# Altium schematic sheet COMMS.schdoc
size 365 x 287 mm
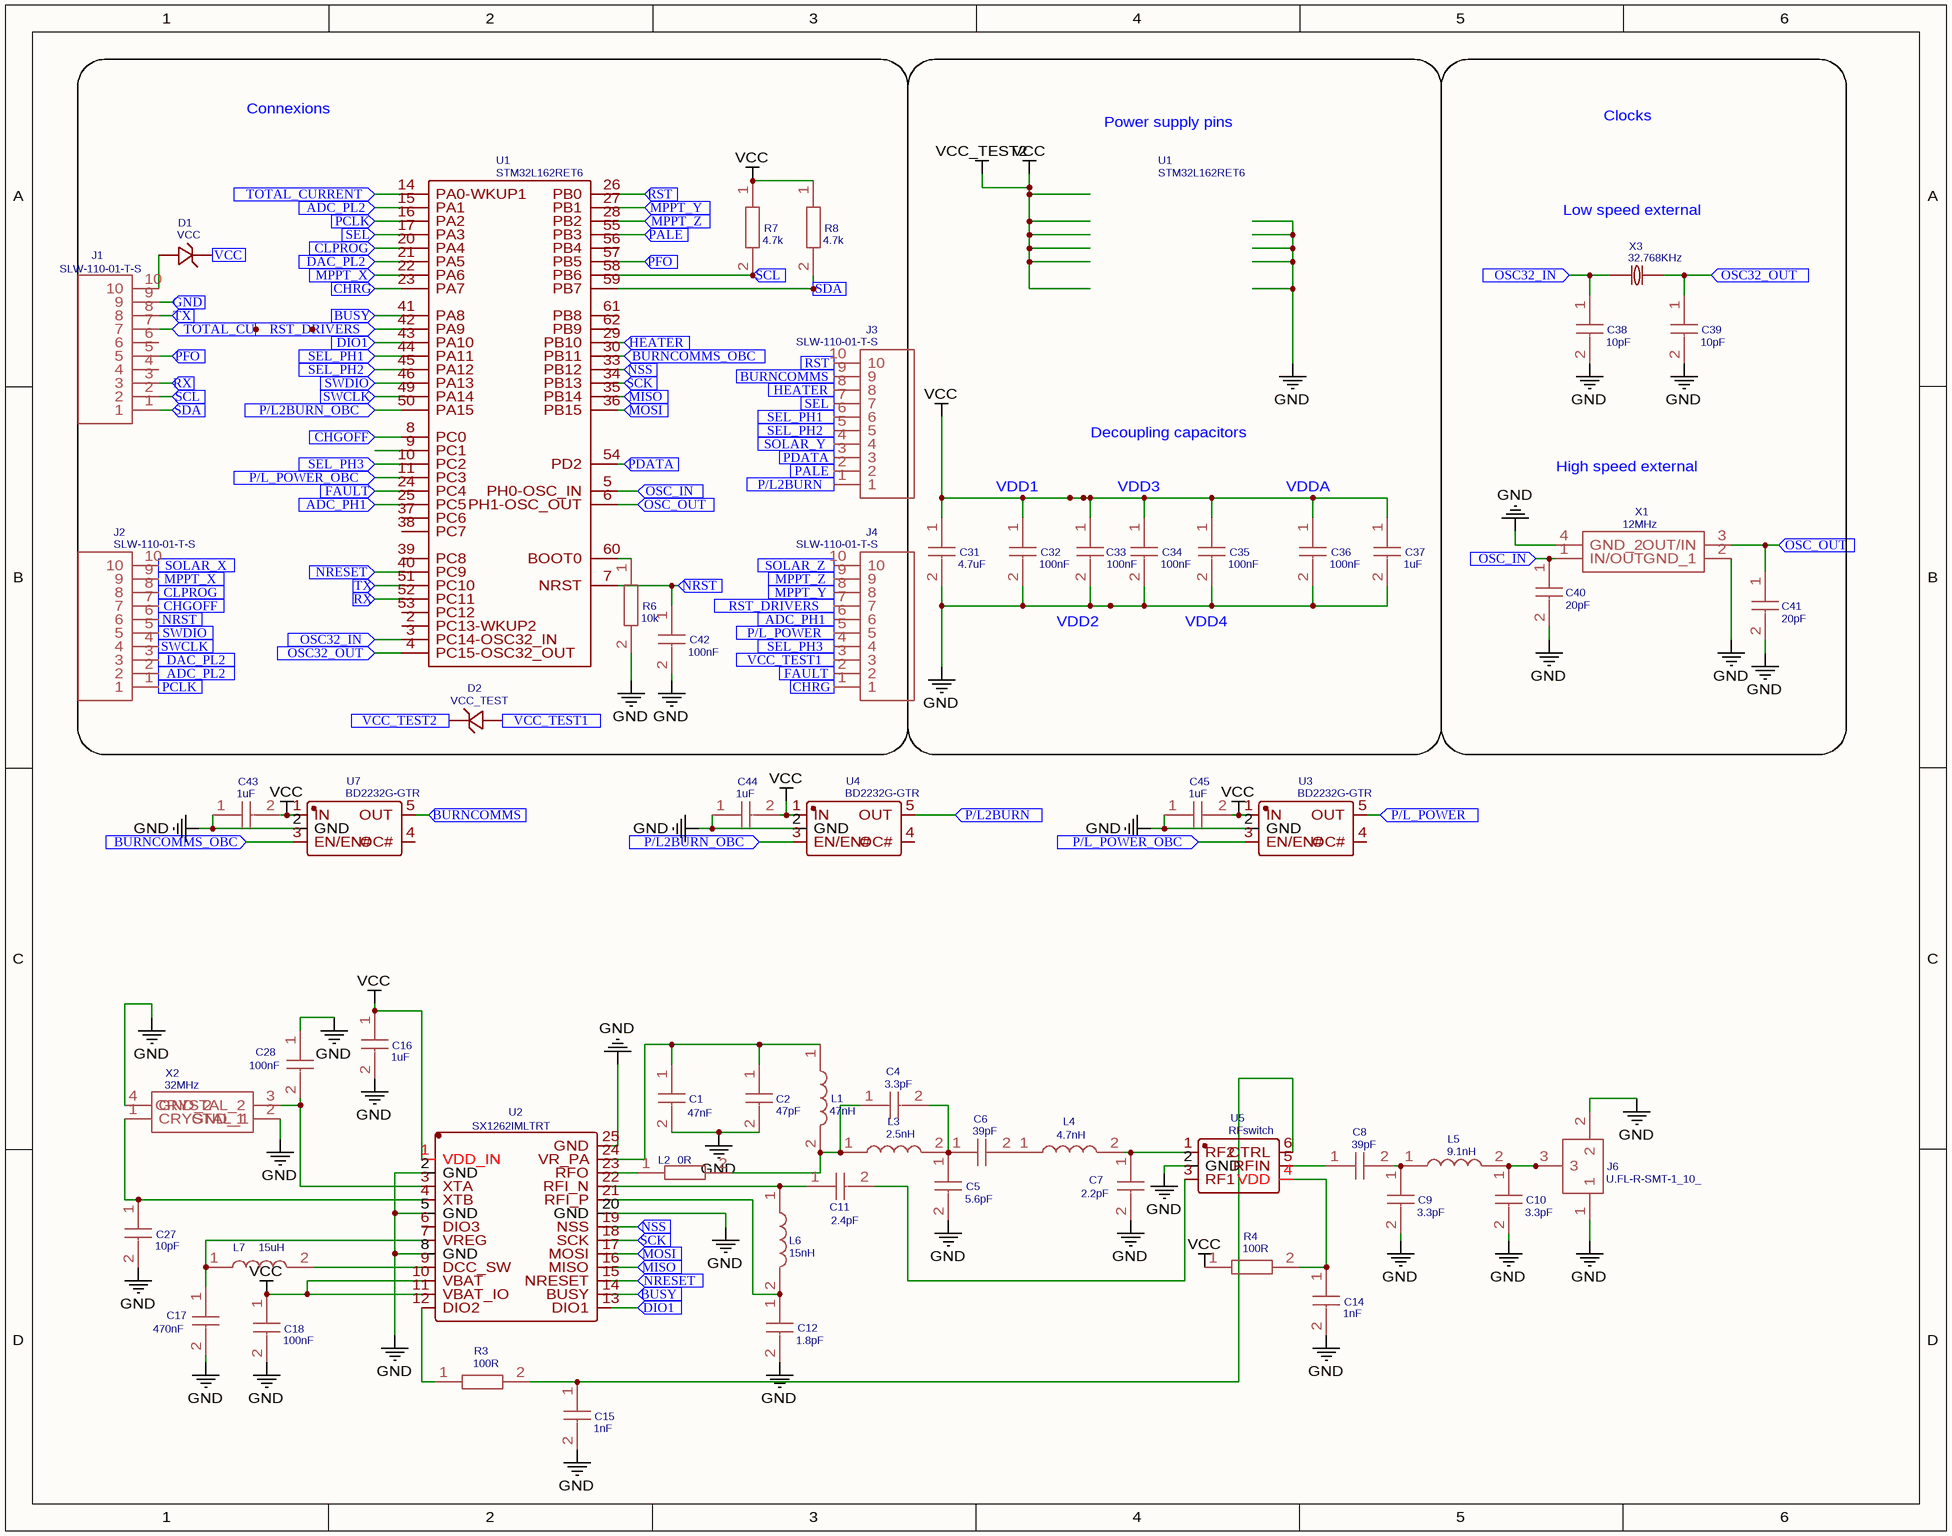
[diagram p0: COMMS.schdoc]

## Parts
(Parts that share a designator on the sheet are numbered #1, #2 ... from top to bottom, then left to right.)
C1  47nF  [CAPC1005X55N]
C2  47pF  [CAPC1005X55N]
C4  3.3pF  [CAPC1005X55N]
C5  5.6pF  [CAPC1005X55N]
C6  39pF  [CAPC1005X55N]
C7  2.2pF  [CAPC1005X55N]
C8  39pF  [CAPC1005X55N]
C9  3.3pF  [CAPC1005X55N]
C10  3.3pF  [CAPC1005X55N]
C11  2.4pF  [CAPC1005X55N]
C12  1.8pF  [CAPC1005X55N]
C14  1nF  [CAPC1608X90N]
C15  1nF  [CAPC1608X90N]
C16  1uF  [CAPC1608X90N]
C17  470nF  [CAPC1608X90N]
C18  100nF  [CAPC1608X90N]
C27  10pF  [CAPC1608X90N]
C28  100nF  [CAPC1608X90N]
C31  4.7uF  [CAPC1608X90N]
C32  100nF  [CAPC1608X90N]
C33  100nF  [CAPC1608X90N]
C34  100nF  [CAPC1608X90N]
C35  100nF  [CAPC1608X90N]
C36  100nF  [CAPC1608X90N]
C37  1uF  [CAPC1608X90N]
C38  10pF  [CAPC1608X80N]
C39  10pF  [CAPC1608X80N]
C40  20pF  [CAPC1608X90N]
C41  20pF  [CAPC1608X90N]
C42  100nF  [CAPC1608X90N]
C43  1uF  [CAPC1608X90N]
C44  1uF  [CAPC1608X90N]
C45  1uF  [CAPC1608X90N]
D1  VCC  [SOD-128_L3.7-W2.5-LS4.7-FD]
D2  VCC_TEST  [SOD-128_L3.7-W2.5-LS4.7-FD]
J1  SLW-110-01-T-S  [SLW-110-01-X-S]
J2  SLW-110-01-T-S  [SLW-110-01-X-S]
J3  SLW-110-01-T-S  [SLW-110-01-X-S]
J4  SLW-110-01-T-S  [SLW-110-01-X-S]
J6  U.FL-R-SMT-1_10_  [U.FL-R-SMT-1(10)]
L1  47nH  [LQW15CNR20J00B]
L2  0R  [RESC1005X35N]
L3  2.5nH  [LQW15CNR20J00B]
L4  4.7nH  [LQW15CNR20J00B]
L5  9.1nH  [LQW15CNR20J00B]
L6  15nH  [LQW15CNR20J00B]
L7  15uH  [INDC2012X145N]
R3  100R  [RESC1608X55N]
R4  100R  [RESC1608X55N]
R6  10k  [RESC1608X55N]
R7  4.7k  [RESC1608X55N]
R8  4.7k  [RESC1608X55N]
U1#1  STM32L162RET6  [STM-LQFP64]
U1#2  STM32L162RET6  [STM-LQFP64]
U2  SX1262IMLTRT  [QFN-24_L4.0-W4.0-P0.50-BL-EP2.6]
U3  BD2232G-GTR  [SSOP-5_L3.0-W1.6-P0.95-LS2.8-TL]
U4  BD2232G-GTR  [SSOP-5_L3.0-W1.6-P0.95-LS2.8-TL]
U5  RFswitch  [TSNP-6_L1.1-W0.7-P0.40-BR]
U7  BD2232G-GTR  [SSOP-5_L3.0-W1.6-P0.95-LS2.8-TL]
X1  12MHz  [ECS1201833JEMTR3]
X2  32MHz  [FA128320000MF20XK5]
X3  32.768KHz  [CRYSTAL-SMD_L4.1-W1.5]

## Blocks framed on the sheet
Connexions: C42 D1 D2 J1-J4 R6-R8 U1#2

## Ports
ADC_PH1 (in), ADC_PL2 (in), BURNCOMMS (in), BURNCOMMS_OBC (in), BUSY (in), CHGOFF (in), CHRG (in), CLPROG (in), DAC_PL2 (in), DIO1 (in), FAULT (in), GND (in), HEATER (in), MISO (in), MOSI (in), MPPT_X (in), MPPT_Y (in), MPPT_Z (in), NRESET (in), NRST (in), NSS (in), OSC32_IN (in), OSC32_OUT (in), OSC_IN (in), OSC_OUT (in), P/L2BURN (in), P/L2BURN_OBC (in), P/L_POWER (in), P/L_POWER_OBC (in), PALE (in), PCLK (in), PDATA (in), PFO (in), RST (in), RST_DRIVERS (in), RX (in), SCK (in), SCL (in), SDA (in), SEL (in), SEL_PH1 (in), SEL_PH2 (in), SEL_PH3 (in), SOLAR_X (in), SOLAR_Y (in), SOLAR_Z (in), SWCLK (in), SWDIO (in), TOTAL_CURRENT (in), TX (in), VCC (in), VCC_TEST1 (in), VCC_TEST2 (in)

## Nets
GND: C1.2 C2.2 C5.2 C7.2 C9.2 C10.2 C12.2 C14.2 C15.2 C16.2 C17.2 C18.2 C27.2 C28.1 C31.2 C32.2 C33.2 C34.2 C35.2 C36.2 C37.2 C38.2 C39.2 C40.2 C41.2 C42.2 C43.1 C44.1 C45.1 J6.1 J6.2 R6.2 U2.2(GND) U2.5(GND) U2.8(GND) U2.20(GND) U2.25(GND) U3.2(GND) U4.2(GND) U5.2(GND) U7.2(GND) X1.2(GND_1) X1.4(GND_2) X2.2(GND_1) X2.4(GND_2)
VCC: C16.1 C18.1 C31.1 C32.1 C33.1 C34.1 C35.1 C36.1 C37.1 C43.2 C44.2 C45.2 R4.1 R7.1 R8.1 U2.1(VDD_IN) U2.10(VBAT) U2.11(VBAT_IO) U3.1(IN) U4.1(IN) U7.1(IN)  [also labelled VCC_TEST2]
ADC_PH1: J4.6 U1#2.25(PC5) ; port ADC_PH1
ADC_PL2: J2.2 U1#2.15(PA1) ; port ADC_PL2
BURNCOMMS: J3.9 U7.5(OUT) ; port BURNCOMMS
BURNCOMMS_OBC: U1#2.30(PB11) U7.3(EN/EN#) ; port BURNCOMMS_OBC
BUSY: U1#2.41(PA8) U2.14(BUSY) ; port BUSY
CHGOFF: J2.7 U1#2.8(PC0) ; port CHGOFF
CHRG: J4.1 U1#2.23(PA7) ; port CHRG
CLPROG: J2.8 U1#2.20(PA4) ; port CLPROG
DAC_PL2: J2.3 U1#2.21(PA5) ; port DAC_PL2
DIO1: U1#2.43(PA10) U2.13(DIO1) ; port DIO1
FAULT: J4.2 U1#2.24(PC4) ; port FAULT
GND: J1.9 ; port GND  [a separate net that carries the same name]
HEATER: J3.8 U1#2.29(PB10) ; port HEATER
MISO: U1#2.35(PB14) U2.16(MISO) ; port MISO
MOSI: U1#2.36(PB15) U2.17(MOSI) ; port MOSI
MPPT_X: J2.9 U1#2.22(PA6) ; port MPPT_X
MPPT_Y: J4.8 U1#2.27(PB1) ; port MPPT_Y
MPPT_Z: J4.9 U1#2.28(PB2) ; port MPPT_Z
NRESET: U1#2.40(PC9) U2.15(NRESET) ; port NRESET
NRST: C42.1 J2.6 U1#2.7(NRST) ; port NRST
NSS: U1#2.33(PB12) U2.19(NSS) ; port NSS
OSC32_IN: C38.1 U1#2.3(PC14-OSC32_IN) X3.1 ; port OSC32_IN
OSC32_OUT: C39.1 U1#2.4(PC15-OSC32_OUT) X3.2 ; port OSC32_OUT
OSC_IN: C40.1 U1#2.5(PH0-OSC_IN) X1.1(IN/OUT) ; port OSC_IN
OSC_OUT: C41.1 U1#2.6(PH1-OSC_OUT) X1.3(OUT/IN) ; port OSC_OUT
P/L2BURN: J3.1 U4.5(OUT) ; port P/L2BURN
P/L2BURN_OBC: U1#2.50(PA15) U4.3(EN/EN#) ; port P/L2BURN_OBC
P/L_POWER: J4.5 U3.5(OUT) ; port P/L_POWER
P/L_POWER_OBC: U1#2.11(PC3) U3.3(EN/EN#) ; port P/L_POWER_OBC
PALE: J3.2 U1#2.55(PB3) ; port PALE
PCLK: J2.1 U1#2.16(PA2) ; port PCLK
PDATA: J3.3 U1#2.54(PD2) ; port PDATA
PFO: J1.5 U1#2.57(PB5) ; port PFO
RST: J3.10 U1#2.26(PB0) ; port RST
RST_DRIVERS: J4.7 U1#2.42(PA9) ; port RST_DRIVERS
RX: J1.3 U1#2.52(PC11) ; port RX
SCK: U1#2.34(PB13) U2.18(SCK) ; port SCK
SCL: J1.2 R7.2 U1#2.58(PB6) ; port SCL
SDA: J1.1 R8.2 U1#2.59(PB7) ; port SDA
SEL: J3.7 U1#2.17(PA3) ; port SEL
SEL_PH1: J3.6 U1#2.44(PA11) ; port SEL_PH1
SEL_PH2: J3.5 U1#2.45(PA12) ; port SEL_PH2
SEL_PH3: J4.4 U1#2.10(PC2) ; port SEL_PH3
SOLAR_X: J2.10 ; port SOLAR_X
SOLAR_Y: J3.4 ; port SOLAR_Y
SOLAR_Z: J4.10 ; port SOLAR_Z
SWCLK: J2.4 U1#2.49(PA14) ; port SWCLK
SWDIO: J2.5 U1#2.46(PA13) ; port SWDIO
TOTAL_CURRENT: J1.7 U1#2.14(PA0-WKUP1) ; port TOTAL_CURRENT
TX: J1.8 U1#2.51(PC10) ; port TX
VCC: D1.1(C) ; port VCC  [a separate net that carries the same name]
VCC_TEST1: D2.2(A) J4.3 ; port VCC_TEST1
VCC_TEST2: D2.1(C) ; port VCC_TEST2
NetC1_1: C1.1 C2.1 L1.1 U2.24(VR_PA)
NetC4_1: C4.1 L1.2 L2.2 L3.1
NetC4_2: C4.2 C5.1 C6.1 L3.2
NetC6_2: C6.2 L4.1
NetC7_1: C7.1 L4.2 U5.1(RF2)
NetC8_1: C8.1 U5.5(RFIN)
NetC8_2: C8.2 C9.1 L5.1
NetC10_1: C10.1 J6.3 L5.2
NetC11_1: C11.1 L6.1 U2.22(RFI_N)
NetC11_2: C11.2 U5.3(RF1)
NetC12_1: C12.1 L6.2 U2.21(RFI_P)
NetC14_1: C14.1 R4.2 U5.4(VDD)
NetC15_1: C15.1 R3.2 U5.6(CTRL)
NetC17_1: C17.1 L7.1 U2.7(VREG)
NetC27_1: C27.1 U2.4(XTB) X2.1(CRYSTAL_1)
NetC28_2: C28.2 U2.3(XTA) X2.3(CRYSTAL_2)
NetD1_2: D1.2(A) J1.10
NetL2_1: L2.1 U2.23(RFO)
NetL7_2: L7.2 U2.9(DCC_SW)
NetR3_1: R3.1 U2.12(DIO2)
NetR6_1: R6.1 U1#2.60(BOOT0)

Not connected (* = marked no-connect by the designer): J1 4 6; U1#2 2(PC13-WKUP2) 9(PC1) 37(PC6) 38(PC7) 39(PC8) 53(PC12) 56(PB4) 61(PB8) 62(PB9); U2 6(DIO3); U3 4(OC#); U4 4(OC#); U7 4(OC#)

## Notes on the sheet
- Power supply pins
- Clocks
- Low speed external
- Decoupling capacitors
- High speed external
- VDD1
- VDD3
- (near C36) VDDA
- VDD2
- VDD4

## Library data of the parts
C1 = 47nF: Contributor: danielCOMMS; spicePre: C; spiceSymbolName: GRM155R71C473KA01J
C2 = 47pF: Contributor: danielCOMMS; spicePre: C; spiceSymbolName: GRM1555C1H470FA01D
C4 C9 C10 = 3.3pF: Contributor: danielCOMMS; spicePre: C; spiceSymbolName: GRM1555C1H3R3BA01D
C5 = 5.6pF: Contributor: danielCOMMS; spicePre: C; spiceSymbolName: GRM1555C1H5R6CA01D
C6 C8 = 39pF: Contributor: danielCOMMS; spicePre: C; spiceSymbolName: GRM1555C1H390JA01D
C7 = 2.2pF: Contributor: danielCOMMS; spicePre: C; spiceSymbolName: GRM1555C1H2R2BA01J
C11 = 2.4pF: Contributor: danielCOMMS; spicePre: C; spiceSymbolName: GRM1555C1H2R4WA01D
C12 = 1.8pF: Contributor: danielCOMMS; spicePre: C; spiceSymbolName: GRM1555C1H1R8BA01D
C14 C15 = 1nF: Contributor: danielCOMMS; spicePre: C; spiceSymbolName: 0603ZD102KAT2A
C16 C37 C43-C45 = 1uF: Contributor: danielCOMMS; spicePre: C; spiceSymbolName: 06033D105KAT2A
C17 = 470nF: Contributor: danielCOMMS; spicePre: C; spiceSymbolName: 0603YD474KAT2A
C18 C28 C32-C36 C42 = 100nF: Contributor: danielCOMMS; spicePre: C; spiceSymbolName: GRM188R72A104KA35J
C27 C38 C39 = 10pF: Contributor: danielCOMMS; spicePre: C
  C27: spiceSymbolName: 06035A100GAT2A
  C38 C39: spiceSymbolName: GQM1875G2E100JB12D
C31 = 4.7uF: Contributor: danielCOMMS; spicePre: C; spiceSymbolName: GRT188R61E475KE13D
C40 C41 = 20pF: Contributor: danielCOMMS; spicePre: C; spiceSymbolName: GRM1885C2A200JA01D
D1 = VCC: BOM_Manufacturer: ROHM Semicon; BOM_Manufacturer Part: PDZVTR4.7B; Contributor: LCSC; BOM_Supplier: LCSC; BOM_Supplier Part: C253498; BOM_JLCPCB Part Class: Extended Part; spicePre: D; spiceSymbolName: PDZVTR4.7B
D2 = VCC_TEST: BOM_Manufacturer: ROHM Semicon; BOM_Manufacturer Part: PDZVTR4.7B; Contributor: LCSC; BOM_Supplier: LCSC; BOM_Supplier Part: C253498; BOM_JLCPCB Part Class: Extended Part; spicePre: D; spiceSymbolName: PDZVTR4.7B
J1-J4 = SLW-110-01-T-S: Contributor: Hans Stahl; spicePre: J; spiceSymbolName: SLW-110-01-T-S
J6 = U.FL-R-SMT-1_10_: Contributor: danielCOMMS; spicePre: J; spiceSymbolName: U.FL-R-SMT-1_10_
L1 = 47nH: Contributor: danielCOMMS; spicePre: L; spiceSymbolName: LQW15AN47NJ00D
L2 = 0R: Contributor: danielCOMMS; spicePre: R; spiceSymbolName: CRCW04020000Z0EDC
L3 = 2.5nH: Contributor: danielCOMMS; spicePre: L; spiceSymbolName: LQW15AN2N5C00D
L4 = 4.7nH: Contributor: danielCOMMS; spicePre: L; spiceSymbolName: LQW15AN4N7C00D
L5 = 9.1nH: Contributor: danielCOMMS; spicePre: L; spiceSymbolName: LQW15AN9N1H00D
L6 = 15nH: Contributor: danielCOMMS; spicePre: L; spiceSymbolName: LQW15AN15NH00D
L7 = 15uH: Contributor: danielCOMMS; spicePre: L; spiceSymbolName: LQM21DN150M70L
R3 R4 = 100R: Contributor: danielCOMMS; spicePre: R; spiceSymbolName: RC0603JR-07100RL
R6 = 10k: Contributor: danielCOMMS; spicePre: R; spiceSymbolName: SG73P1JTTD1002F
R7 R8 = 4.7k: Contributor: danielCOMMS; spicePre: R; spiceSymbolName: CRCW06034K70JNEAC
U1#1 U1#2 = STM32L162RET6: subpart_no: 1; spicePre: U; spiceSymbolName: STM32L162RET6
U2 = SX1262IMLTRT: BOM_Manufacturer: SEMTECH; Contributor: LCSC; SMT Type: Extend; BOM_Paste Type: expand; BOM_Supplier: LCSC; BOM_Supplier Part: C191341; BOM_Manufacturer Part: SX1262IMLTRT; BOM_JLCPCB SMD: Yes; BOM_LCSC Assembly: Yes; spicePre: U; spiceSymbolName: SX1262IMLTRT
U3 U4 U7 = BD2232G-GTR: BOM_Manufacturer: ROHM Semicon; Contributor: LCSC; BOM_Supplier: LCSC; BOM_Supplier Part: C308588; BOM_Manufacturer Part: BD2232G-GTR; BOM_JLCPCB Part Class: Extended Part; spicePre: U; spiceSymbolName: BD2232G-GTR
U5 = RFswitch: BOM_Manufacturer: Infineon(英飞凌); BOM_Manufacturer Part: BGS12WN6E6327XTSA1; Contributor: LCSC; BOM_Supplier: LCSC; BOM_Supplier Part: C1854968; BOM_JLCPCB Part Class: Extended Part; spicePre: U; spiceSymbolName: BGS12WN6E6327XTSA1
X1 = 12MHz: Contributor: danielCOMMS; spicePre: Y; spiceSymbolName: ECS-120-18-33-JEM-TR3
X2 = 32MHz: Contributor: danielCOMMS; spicePre: Y; spiceSymbolName: FA-128_32.0000MF20X-K5
X3 = 32.768KHz: BOM_Manufacturer: ABRACON; BOM_Manufacturer Part: ABS09-32.768KHZ-7-T; Contributor: LCSC; BOM_Supplier: LCSC; BOM_Supplier Part: C1985392; spicePre: X; spiceSymbolName: ABS09-32.768KHZ-7-T